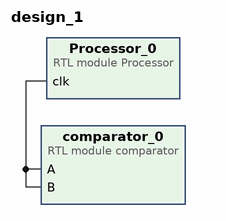
[diagram p0: block diagram of the top level]
# Vivado block design design_1, xc7a35tcpg236-1, Vivado 2019.2
create_bd_design design_1

create_bd_cell -type module -reference Processor Processor_0
create_bd_cell -type module -reference comparator comparator_0

# ---- connections ----

connect_bd_net [get_bd_pins comparator_0/A] [get_bd_pins Processor_0/clk] [get_bd_pins comparator_0/B]

validate_bd_design
save_bd_design
